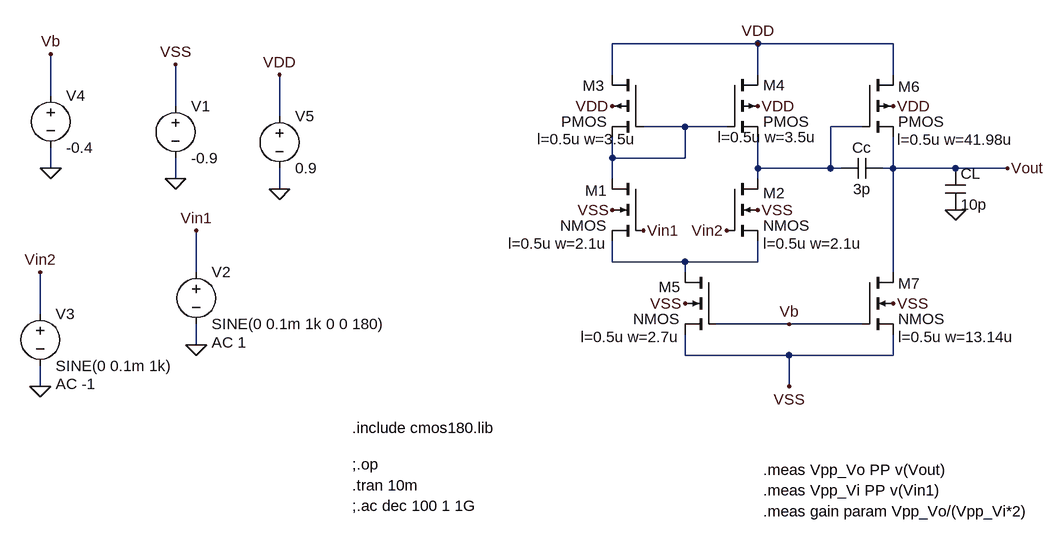
[diagram p0: schematic op.asc]
op.asc, the LTspice schematic file:
Version 4
SHEET 1 952 680
WIRE 32 -256 -192 -256
WIRE 240 -256 32 -256
WIRE -192 -208 -192 -256
WIRE 32 -208 32 -256
WIRE 240 -208 240 -256
WIRE -1056 -176 -1056 -240
WIRE -864 -160 -864 -224
WIRE -704 -144 -704 -208
WIRE -80 -128 -144 -128
WIRE -16 -128 -80 -128
WIRE 192 -128 144 -128
WIRE -192 -80 -192 -112
WIRE -80 -80 -80 -128
WIRE -80 -80 -192 -80
WIRE -1056 -64 -1056 -96
WIRE 32 -64 32 -112
WIRE 144 -64 144 -128
WIRE 144 -64 32 -64
WIRE 160 -64 144 -64
WIRE 240 -64 240 -112
WIRE 240 -64 224 -64
WIRE 336 -64 240 -64
WIRE 416 -64 336 -64
WIRE -864 -48 -864 -80
WIRE -192 -48 -192 -80
WIRE 32 -48 32 -64
WIRE -704 -32 -704 -64
WIRE -192 80 -192 48
WIRE -80 80 -192 80
WIRE 32 80 32 48
WIRE 32 80 -80 80
WIRE -832 96 -832 32
WIRE -80 96 -80 80
WIRE 240 96 240 -64
WIRE -1072 160 -1072 96
WIRE 80 176 -32 176
WIRE 192 176 80 176
WIRE -832 208 -832 176
WIRE -80 224 -80 192
WIRE 80 224 -80 224
WIRE 240 224 240 192
WIRE 240 224 80 224
WIRE -1072 272 -1072 240
WIRE 80 272 80 224
FLAG -192 -160 VDD
FLAG 32 -160 VDD
FLAG 240 -160 VDD
FLAG 416 -64 Vout
FLAG 336 0 0
FLAG 32 -256 VDD
FLAG -864 -48 0
FLAG -832 208 0
FLAG -1072 272 0
FLAG -1056 -64 0
FLAG -864 -224 VSS
FLAG -144 32 Vin1
FLAG -16 32 Vin2
FLAG -832 32 Vin1
FLAG -1072 96 Vin2
FLAG -1056 -240 Vb
FLAG 80 176 Vb
FLAG -192 0 VSS
FLAG 32 0 VSS
FLAG -80 144 VSS
FLAG 240 144 VSS
FLAG 80 272 VSS
FLAG -704 -32 0
FLAG -704 -208 VDD
SYMBOL pmos4 -144 -208 M0
WINDOW 0 60 17 Left 2
WINDOW 123 11 99 Left 2
SYMATTR InstName M3
SYMATTR Value2 l=0.5u w=3.5u
SYMBOL pmos4 -16 -208 R0
WINDOW 0 56 16 Left 2
WINDOW 123 -14 96 Left 2
SYMATTR InstName M4
SYMATTR Value2 l=0.5u w=3.5u
SYMBOL nmos4 -144 -48 M0
WINDOW 0 56 18 Left 2
WINDOW 123 56 100 Left 2
SYMATTR InstName M1
SYMATTR Value2 l=0.5u w=2.1u
SYMBOL nmos4 -16 -48 R0
WINDOW 0 56 22 Left 2
WINDOW 123 56 100 Left 2
SYMATTR InstName M2
SYMATTR Value2 l=0.5u w=2.1u
SYMBOL nmos4 -32 96 M0
WINDOW 0 55 23 Left 2
WINDOW 123 56 100 Left 2
SYMATTR InstName M5
SYMATTR Value2 l=0.5u w=2.7u
SYMBOL pmos4 192 -208 R0
WINDOW 0 56 18 Left 2
WINDOW 123 54 100 Left 2
SYMATTR InstName M6
SYMATTR Value2 l=0.5u w=41.98u
SYMBOL nmos4 192 96 R0
WINDOW 0 56 17 Left 2
WINDOW 123 56 100 Left 2
SYMATTR InstName M7
SYMATTR Value2 l=0.5u w=13.14u
SYMBOL cap 320 -64 R0
SYMATTR InstName CL
SYMATTR Value 10p
SYMBOL cap 224 -80 R90
WINDOW 0 0 32 VBottom 2
WINDOW 3 32 32 VTop 2
SYMATTR InstName Cc
SYMATTR Value 3p
SYMBOL voltage -864 -176 R0
WINDOW 123 0 0 Left 2
WINDOW 39 0 0 Left 2
SYMATTR InstName V1
SYMATTR Value -0.9
SYMBOL voltage -832 80 R0
WINDOW 123 24 124 Left 2
WINDOW 39 0 0 Left 2
SYMATTR Value2 AC 1
SYMATTR InstName V2
SYMATTR Value SINE(0 0.1m 1k 0 0 180)
SYMBOL voltage -1072 144 R0
WINDOW 123 24 124 Left 2
WINDOW 39 0 0 Left 2
SYMATTR Value2 AC -1
SYMATTR InstName V3
SYMATTR Value SINE(0 0.1m 1k)
SYMBOL voltage -1056 -192 R0
WINDOW 123 0 0 Left 2
WINDOW 39 0 0 Left 2
SYMATTR InstName V4
SYMATTR Value -0.4
SYMBOL voltage -704 -160 R0
WINDOW 123 0 0 Left 2
WINDOW 39 0 0 Left 2
SYMATTR InstName V5
SYMATTR Value 0.9
TEXT -592 424 Left 2 !.tran 10m
TEXT 40 400 Left 2 !.meas Vpp_Vo PP v(Vout)
TEXT 40 432 Left 2 !.meas Vpp_Vi PP v(Vin1)
TEXT 40 464 Left 2 !.meas gain param Vpp_Vo/(Vpp_Vi*2)
TEXT -592 456 Left 2 !;.ac dec 100 1 1G
TEXT -592 392 Left 2 !;.op
TEXT -592 336 Left 2 !.include cmos180.lib

The netlist it stands for:
* op.asc
M3 VDD N001 N001 VDD PMOS l=0.5u w=3.5u
M4 VDD N001 N002 VDD PMOS l=0.5u w=3.5u
M1 N001 Vin1 N003 VSS NMOS l=0.5u w=2.1u
M2 N002 Vin2 N003 VSS NMOS l=0.5u w=2.1u
M5 N003 Vb VSS VSS NMOS l=0.5u w=2.7u
M6 VDD N002 Vout VDD PMOS l=0.5u w=41.98u
M7 Vout Vb VSS VSS NMOS l=0.5u w=13.14u
CL Vout 0 10p
Cc Vout N002 3p
V1 VSS 0 -0.9
V2 Vin1 0 SINE(0 0.1m 1k 0 0 180) AC 1
V3 Vin2 0 SINE(0 0.1m 1k) AC -1
V4 Vb 0 -0.4
V5 VDD 0 0.9
.model NMOS NMOS
.model PMOS PMOS
.lib standard.mos
.tran 10m
.meas Vpp_Vo PP v(Vout)
.meas Vpp_Vi PP v(Vin1)
.meas gain param Vpp_Vo/(Vpp_Vi*2)
;.ac dec 100 1 1G
;.op
.include cmos180.lib
.backanno
.end